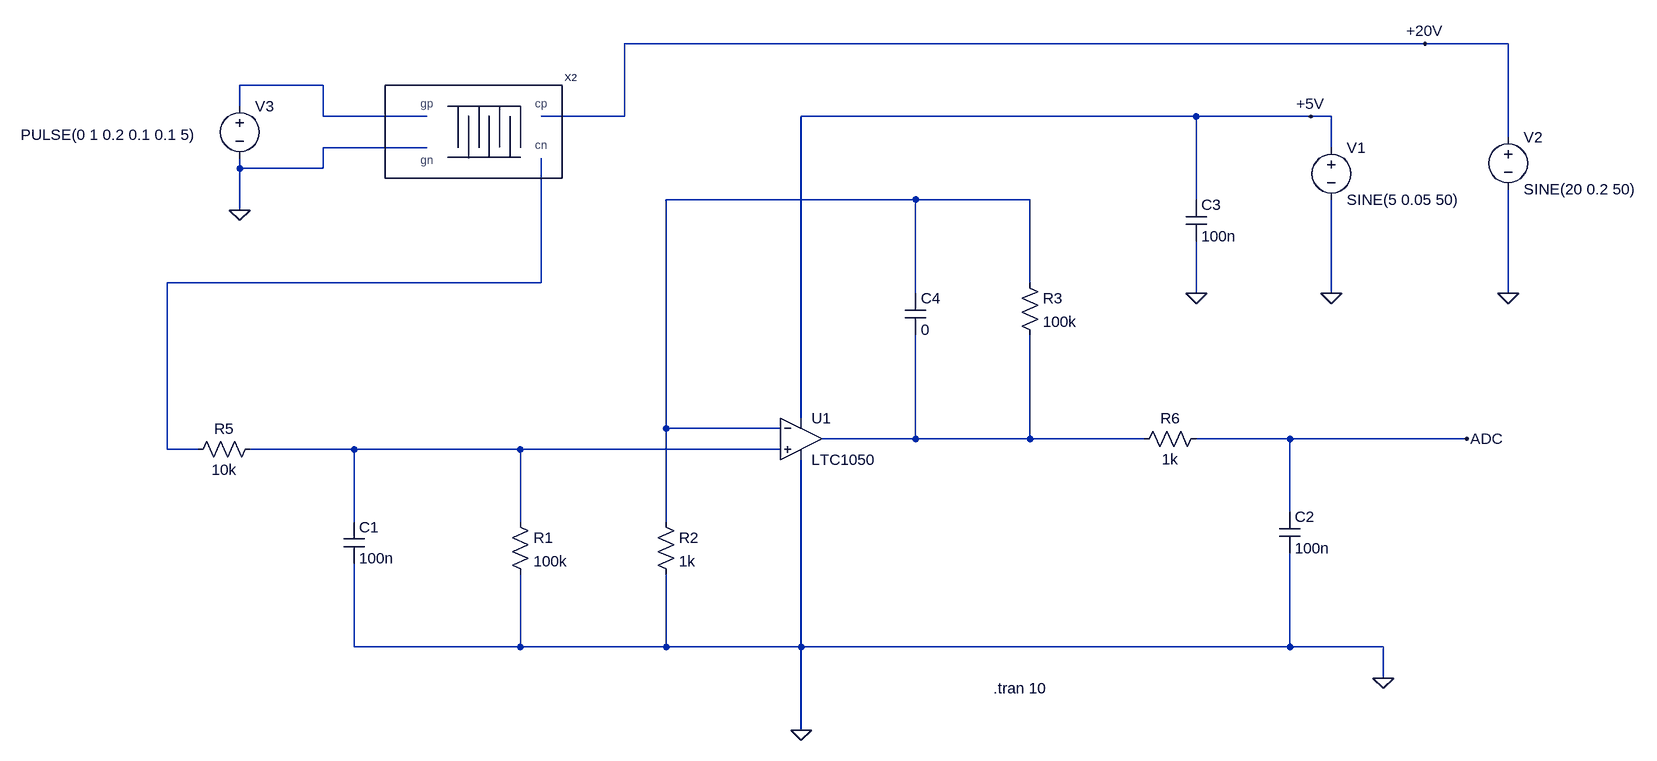
[diagram p0: schematic Draft_main_shield.asc]
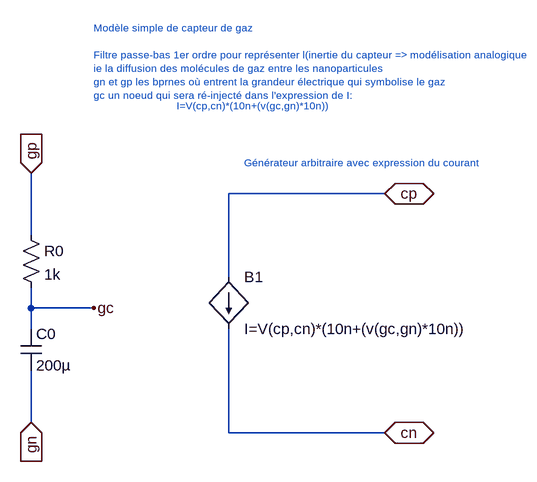
[diagram p1: sub-circuit gaz.asc]
Draft_main_shield.asc, the LTspice schematic file:
Version 4
SHEET 1 1444 680
WIRE 1104 -480 -128 -480
WIRE 1232 -480 1104 -480
WIRE -592 -416 -720 -416
WIRE -720 -384 -720 -416
WIRE -592 -368 -592 -416
WIRE -432 -368 -592 -368
WIRE -128 -368 -128 -480
WIRE -128 -368 -256 -368
WIRE 752 -368 144 -368
WIRE 928 -368 752 -368
WIRE 960 -368 928 -368
WIRE 1232 -336 1232 -480
WIRE -432 -320 -592 -320
WIRE 960 -320 960 -368
WIRE -720 -288 -720 -304
WIRE -592 -288 -592 -320
WIRE -592 -288 -720 -288
WIRE 320 -240 -64 -240
WIRE 496 -240 320 -240
WIRE 752 -240 752 -368
WIRE -720 -224 -720 -288
WIRE -256 -112 -256 -304
WIRE -256 -112 -832 -112
WIRE 496 -112 496 -240
WIRE 320 -96 320 -240
WIRE 752 -96 752 -176
WIRE 960 -96 960 -240
WIRE 1232 -96 1232 -256
WIRE 144 96 144 -368
WIRE -64 112 -64 -240
WIRE 112 112 -64 112
WIRE 320 128 320 -32
WIRE 320 128 176 128
WIRE 496 128 496 -32
WIRE 496 128 320 128
WIRE 672 128 496 128
WIRE 896 128 752 128
WIRE 1168 128 896 128
WIRE -832 144 -832 -112
WIRE -784 144 -832 144
WIRE -544 144 -704 144
WIRE -288 144 -544 144
WIRE 112 144 -288 144
WIRE 896 240 896 128
WIRE -544 256 -544 144
WIRE -288 256 -288 144
WIRE -64 256 -64 112
WIRE -544 448 -544 320
WIRE -288 448 -288 336
WIRE -288 448 -544 448
WIRE -64 448 -64 336
WIRE -64 448 -288 448
WIRE 144 448 144 160
WIRE 144 448 -64 448
WIRE 896 448 896 304
WIRE 896 448 144 448
WIRE 1040 448 896 448
WIRE 1040 496 1040 448
WIRE 144 576 144 448
FLAG 144 576 0
FLAG 1040 496 0
FLAG 1168 128 ADC
FLAG 960 -96 0
FLAG 928 -368 +5V
FLAG -720 -224 0
FLAG 1232 -96 0
FLAG 752 -96 0
FLAG 1104 -480 +20V
SYMBOL OpAmps\\LTC1050 144 64 R0
SYMATTR InstName U1
SYMBOL res -304 240 R0
SYMATTR InstName R1
SYMATTR Value 100k
SYMBOL res -80 240 R0
SYMATTR InstName R2
SYMATTR Value 1k
SYMBOL cap -560 256 R0
SYMATTR InstName C1
SYMATTR Value 100n
SYMBOL res -688 128 R90
WINDOW 0 0 56 VBottom 2
WINDOW 3 32 56 VTop 2
SYMATTR InstName R5
SYMATTR Value 10k
SYMBOL res 480 -128 R0
SYMATTR InstName R3
SYMATTR Value 100k
SYMBOL cap 304 -96 R0
SYMATTR InstName C4
SYMATTR Value 0
SYMBOL res 768 112 R90
WINDOW 0 0 56 VBottom 2
WINDOW 3 32 56 VTop 2
SYMATTR InstName R6
SYMATTR Value 1k
SYMBOL cap 880 240 R0
SYMATTR InstName C2
SYMATTR Value 100n
SYMBOL voltage 960 -336 R0
WINDOW 123 0 0 Left 0
WINDOW 39 0 0 Left 0
SYMATTR InstName V1
SYMATTR Value SINE(5 0.05 50)
SYMBOL voltage -720 -400 R0
WINDOW 3 -337 60 Left 2
WINDOW 123 0 0 Left 0
WINDOW 39 0 0 Left 0
SYMATTR Value PULSE(0 1 0.2 0.1 0.1 5)
SYMATTR InstName V3
SYMBOL voltage 1232 -352 R0
WINDOW 123 0 0 Left 0
WINDOW 39 0 0 Left 0
SYMATTR InstName V2
SYMATTR Value SINE(20 0.2 50)
SYMBOL gaz -352 -352 R0
SYMATTR InstName X2
SYMBOL cap 736 -240 R0
SYMATTR InstName C3
SYMATTR Value 100n
TEXT 440 512 Left 2 !.tran 10

gaz.asc, the sub-circuit schematic file:
Version 4
SHEET 1 1536 680
WIRE 640 0 400 0
WIRE 96 64 96 -32
WIRE 400 128 400 0
WIRE 96 176 96 144
WIRE 192 176 96 176
WIRE 96 208 96 176
WIRE 96 352 96 272
WIRE 400 368 400 208
WIRE 640 368 400 368
FLAG 640 0 cp
IOPIN 640 0 BiDir
FLAG 640 368 cn
IOPIN 640 368 BiDir
FLAG 96 -32 gp
IOPIN 96 -32 In
FLAG 96 352 gn
IOPIN 96 352 In
FLAG 192 176 gc
SYMBOL res 80 48 R0
SYMATTR InstName R0
SYMATTR Value 1k
SYMBOL cap 80 208 R0
SYMATTR InstName C0
SYMATTR Value 200µ
SYMBOL bi 400 128 R0
SYMATTR InstName B1
SYMATTR Value I=V(cp,cn)*(10n+(v(gc,gn)*10n))
TEXT 192 -256 Left 1 ;Modèle simple de capteur de gaz\n \nFiltre passe-bas 1er ordre pour représenter l(inertie du capteur => modélisation analogique\nie la diffusion des molécules de gaz entre les nanoparticules\ngn et gp les bprnes où entrent la grandeur électrique qui symbolise le gaz\ngc un noeud qui sera ré-injecté dans l'expression de I:
TEXT 424 -48 Left 1 ;Générateur arbitraire avec expression du courant
TEXT 320 -136 Left 1 ;I=V(cp,cn)*(10n+(v(gc,gn)*10n))

The netlist it stands for:
* Draft_main_shield.asc
XU1 N005 N002 +5V 0 N004 LTC1050  ; pins In+ In- V+ V- OUT
R1 N005 0 100k
R2 N002 0 1k
C1 N005 0 100n
R5 N005 N003 10k
R3 N002 N004 100k
C4 N002 N004 0
R6 ADC N004 1k
C2 ADC 0 100n
V1 +5V 0 SINE(5 0.05 50)
V3 N001 0 PULSE(0 1 0.2 0.1 0.1 5)
V2 +20V 0 SINE(20 0.2 50)
XX2 N001 0 +20V N003 gaz
C3 +5V 0 100n

* block symbol definitions
.subckt gaz gp gn cp cn
R0 gp gc 1k
C0 gc gn 200µ
B1 cp cn I=V(cp,cn)*(10n+(v(gc,gn)*10n))
* Modèle simple de capteur de gaz
* Filtre passe-bas 1er ordre pour représenter l(inertie du capteur => modélisation analogique
* ie la diffusion des molécules de gaz entre les nanoparticules
* gn et gp les bprnes où entrent la grandeur électrique qui symbolise le gaz
* gc un noeud qui sera ré-injecté dans l'expression de I:
* Générateur arbitraire avec expression du courant
* I=V(cp,cn)*(10n+(v(gc,gn)*10n))
.ends gaz

.tran 10
.lib LTC.lib
.backanno
.end